# Altium project NG_0036526167_Diplomski-rad-BioMed.PrjPcb
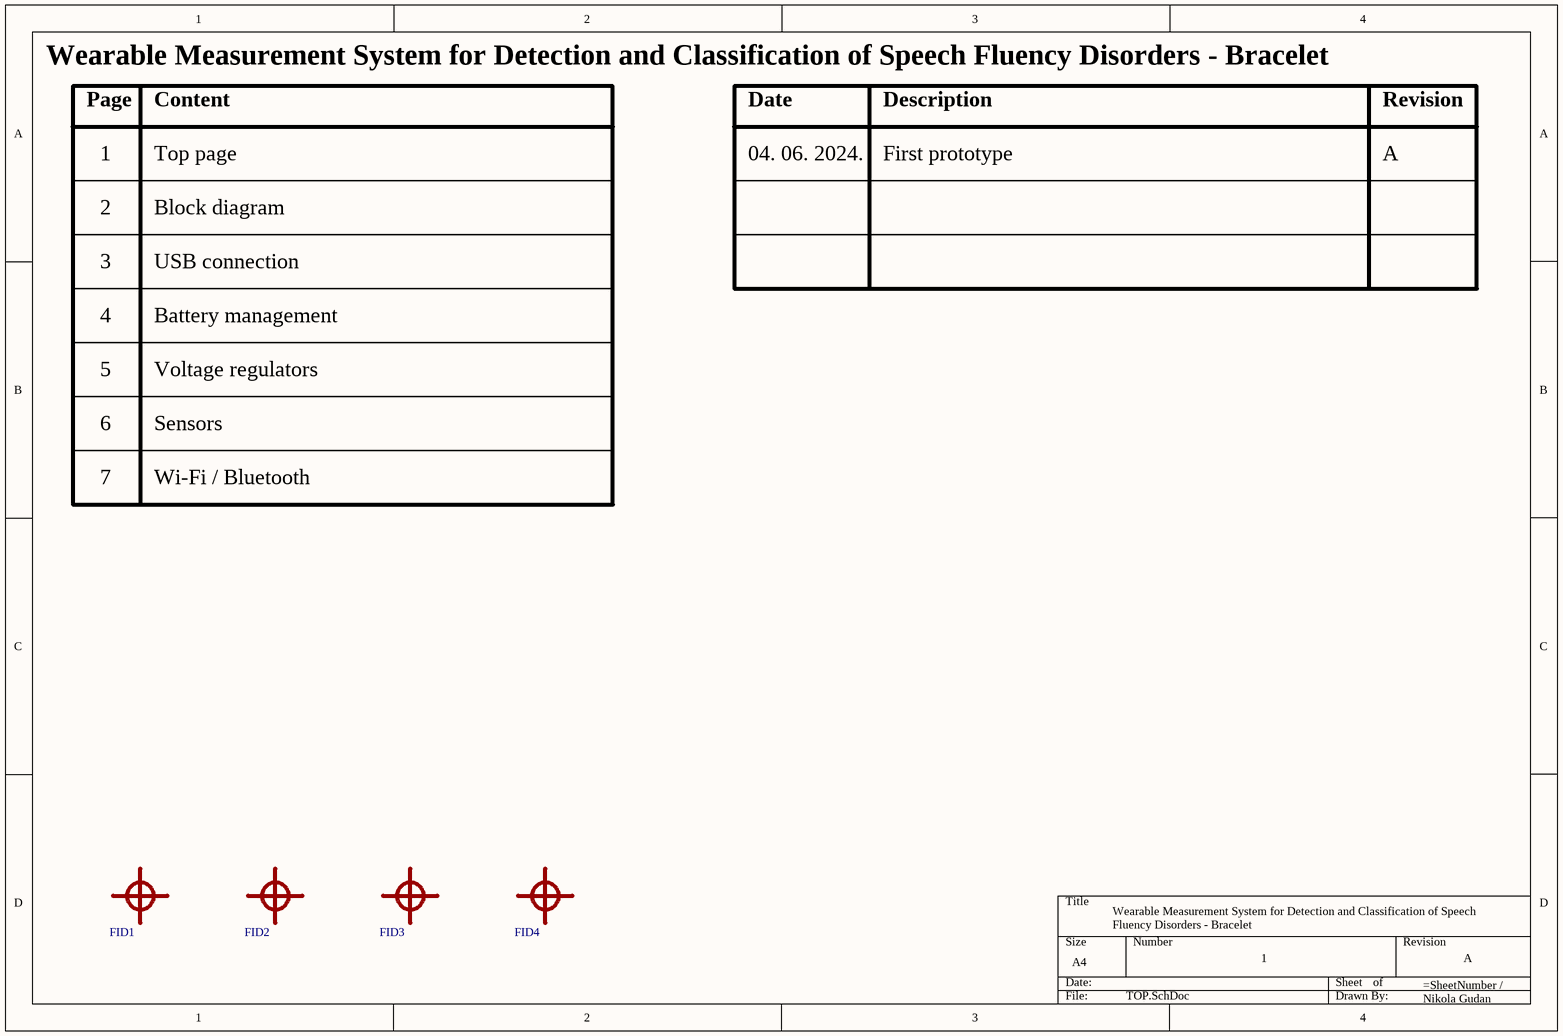
[diagram p0: TOP.SchDoc]
Engineer: Nikola Gudan; Revision: A; Title: Wearable Measurement System for Detection and Classification of Speech Fluency Disorders - Bracelet
7 sheets, 115 parts. Net scope: flat (ports and power ports of the same name join across sheets).
Board file: PCB_4-layer.PcbDoc
Sheets:
  TOP.SchDoc
  BLOCK-DIAGRAM.SchDoc
  USB.SchDoc
  CHARGER.SchDoc
  POWER.SchDoc
  SENSORS.SchDoc
  WIRELESS.SchDoc

## Sheet TOP.SchDoc: Wearable Measurement System for Detection and Classification of Speech Fluency Disorders - Bracelet
size A4; SheetNumber: 1; SheetTotal: 7

### Parts
FID1  FID  [FIDUCIAL]  (value not drawn)  (no BOM)
FID2  FID  [FIDUCIAL]  (value not drawn)  (no BOM)
FID3  FID  [FIDUCIAL]  (value not drawn)  (no BOM)
FID4  FID  [FIDUCIAL]  (value not drawn)  (no BOM)

### Notes on the sheet
- Page
- Content
- Date
- Description
- Revision
- 1
- Top page
- 04. 06. 2024.
- First prototype
- A
- 2
- Block diagram
- 3
- USB connection
- 4
- 5
- Battery management
- Voltage regulators
- 6
- Sensors
- 7
- Wi-Fi / Bluetooth

### Library data of the parts
FID1-FID4 = FIDUCIAL: Fiducial marker; Checked: Yes; Footprint: ?; MFR: ?; Supplier: Digi-Key; SPN: ?; MFRN: ?

## Sheet BLOCK-DIAGRAM.SchDoc: Wearable Measurement System for Detection and Classification of Speech Fluency Disorders - Bracelet
size A4; SheetNumber: 2; SheetTotal: 7
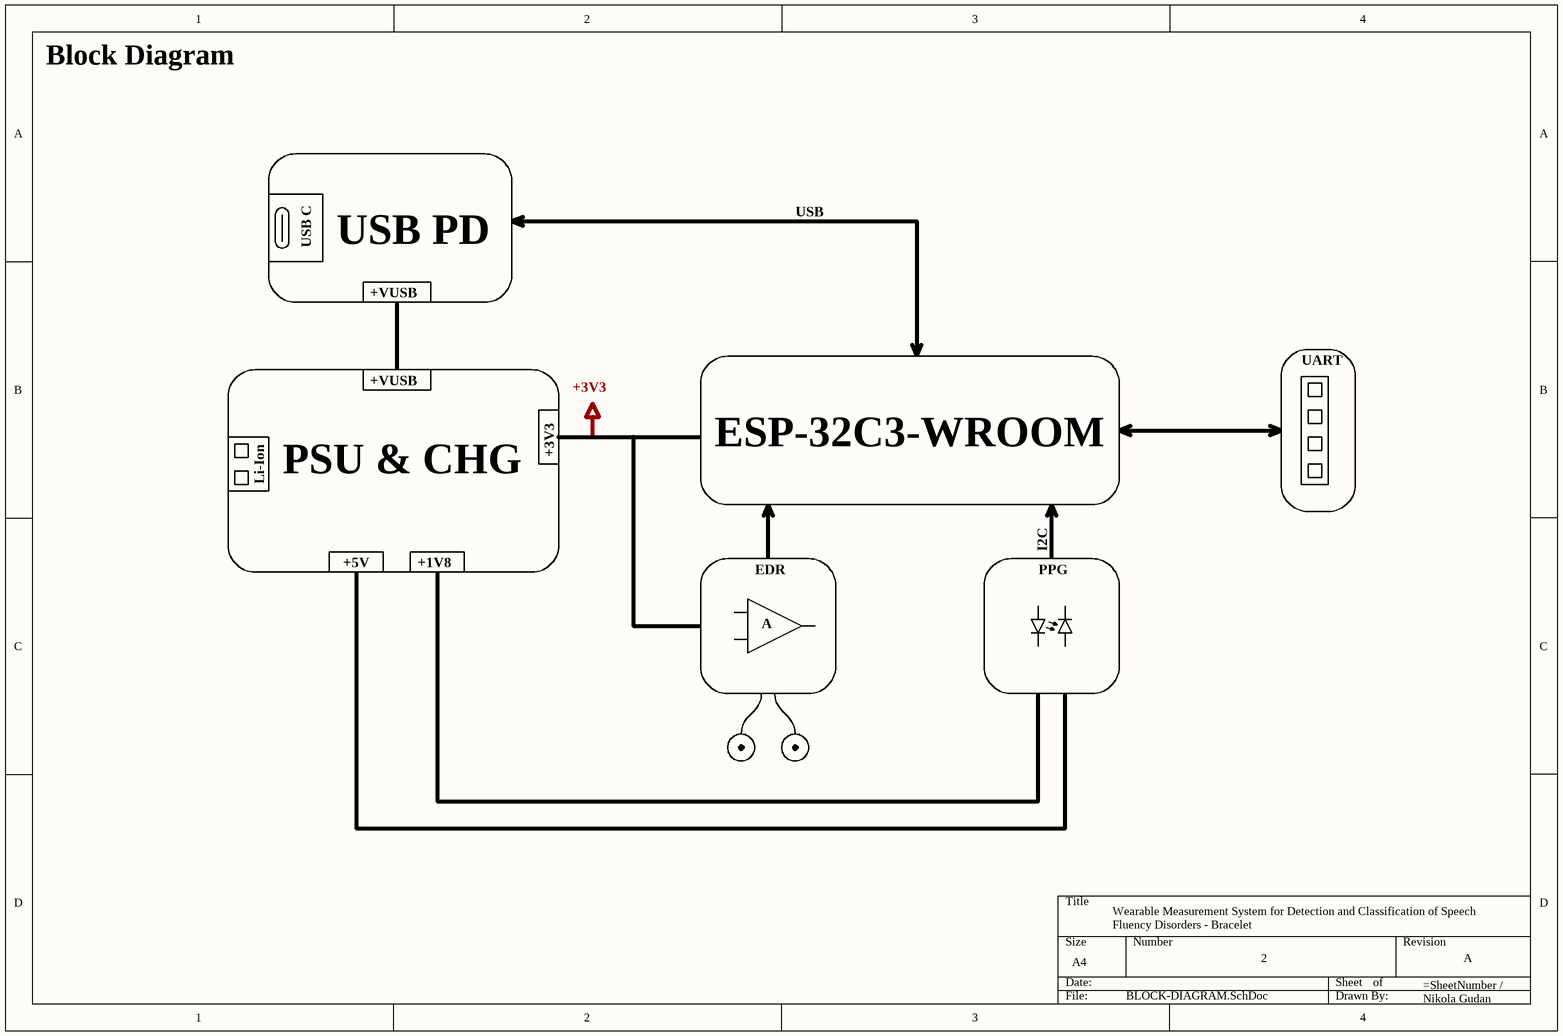
[diagram p1: BLOCK-DIAGRAM.SchDoc]

### Notes on the sheet
- Block Diagram
- USB C
- USB PD
- USB
- +VUSB
- UART
- +3V3
- Li-Ion
- PSU & CHG
- ESP-32C3-WROOM
- +5V
- +1V8
- EDR
- PPG
- I2C
- A

## Sheet USB.SchDoc: Wearable Measurement System for Detection and Classification of Speech Fluency Disorders - Bracelet
size A4; SheetNumber: 3; SheetTotal: 7
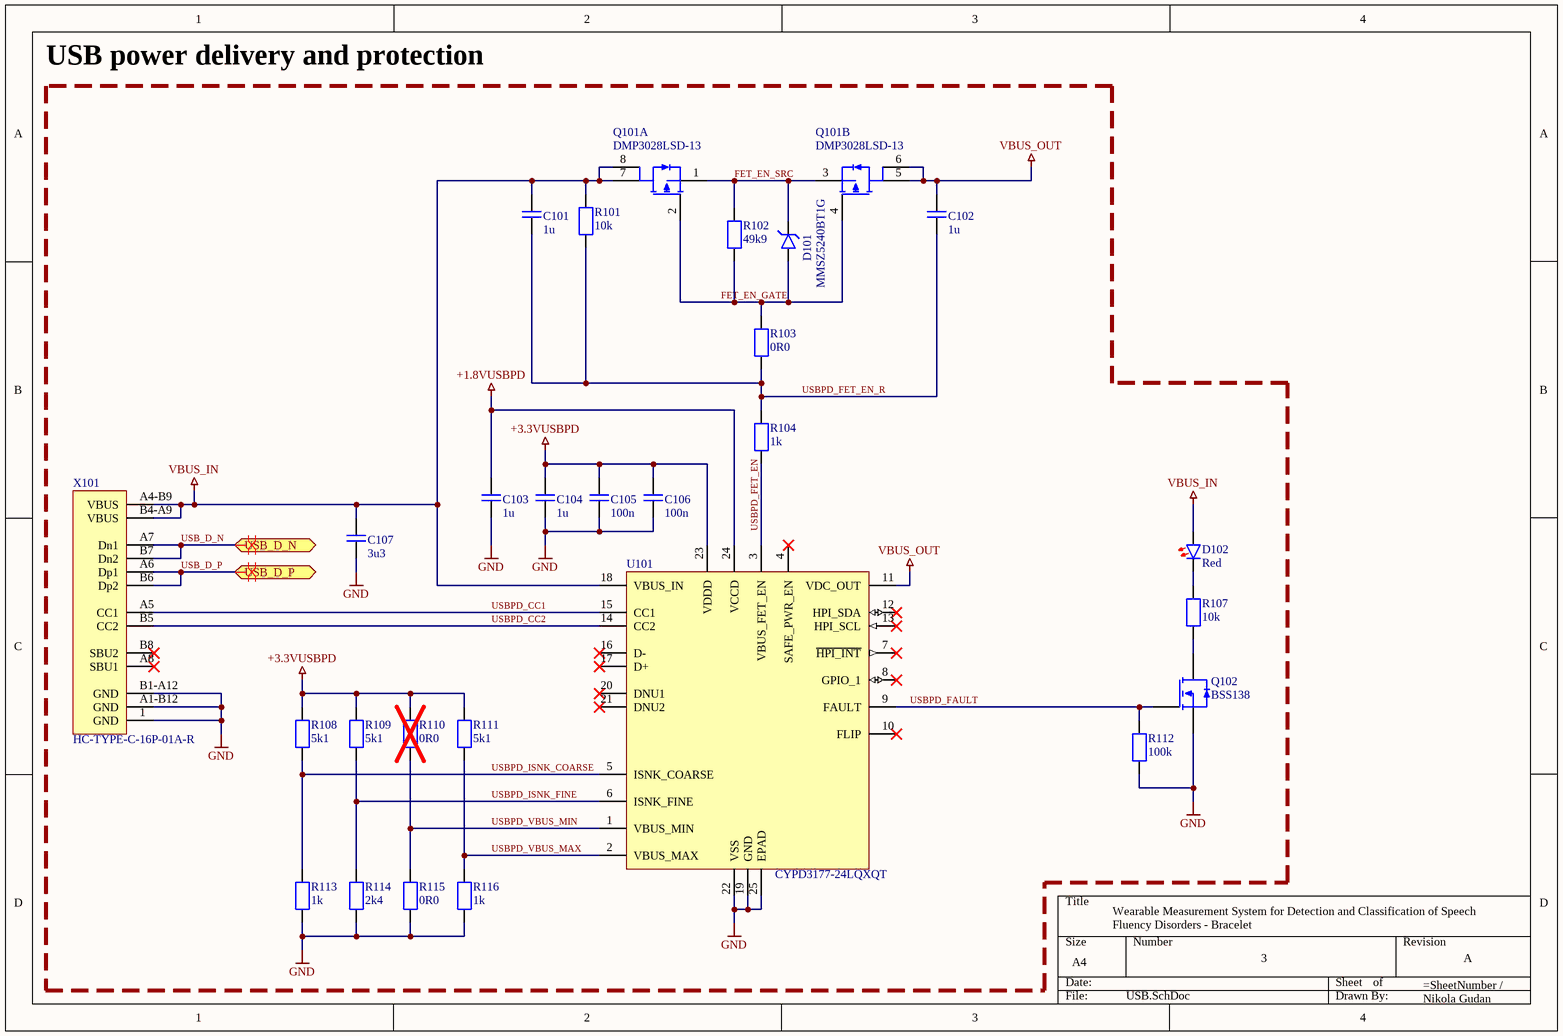
[diagram p2: USB.SchDoc]

### Parts
C101  1u  [CAPC0603]
C102  1u  [CAPC0603]
C103  1u  [CAPC0603]
C104  1u  [CAPC0603]
C105  100n  [CAPC0603]
C106  100n  [CAPC0603]
C107  3u3  [CAPC0603]
D101  MMSZ5240BT1G  [SODFL368160X117]
D102  Red  [LED0603]
Q101  DMP3028LSD-13  [SOIC127P620X175-8]  (parts A,B of 2)
Q102  BSS138  [SOT190P240X290-3]
R101  10k  [RESC0603]
R102  49k9  [RESC0603]
R103  0R0  [RESC0603]
R104  1k  [RESC0603]
R107  10k  [RESC0603]
R108  5k1  [RESC0603]
R109  5k1  [RESC0603]
R110  0R0  [RESC0603]
R111  5k1  [RESC0603]
R112  100k  [RESC0603]
R113  1k  [RESC0603]
R114  2k4  [RESC0603]
R115  0R0  [RESC0603]
R116  1k  [RESC0603]
U101  CYPD3177-24LQXQT  [QFN50P410X410X100-24EP]
X101  HC-TYPE-C-16P-01A-R  [GCT_USB4105-GF-A]

### Blocks framed on the sheet
USB power delivery and protection: C101-C107 D101 D102 Q101 Q102 R101-R104 R107-R116 U101 X101

### Ports
USB_D_N (bidir, see WIRELESS[2B]), USB_D_P (bidir, see WIRELESS[2B])

### Nets
+1.8VUSBPD: C103.2 U101.24(VCCD)
+3.3VUSBPD: C104.2 C105.2 C106.2 R108.2 R109.2 R110.2 R111.2 U101.23(VDDD)
GND: C103.1 C104.1 C105.1 C106.1 C107.1 Q102.2(S) R112.1 R113.1 R114.1 R115.1 R116.1 U101.19(GND) U101.22(VSS) U101.25(EPAD) X101.1(GND) X101.A1-B12(GND) X101.B1-A12(GND)
VBUS_IN: C101.2 C107.2 D102.2 Q101.7(D1) Q101.8(D1) R101.2 U101.18(VBUS_IN) X101.A4-B9(VBUS) X101.B4-A9(VBUS)
VBUS_OUT: C102.2 Q101.5(D2) Q101.6(D2) U101.11(VDC_OUT)
FET_EN_GATE: D101.2 Q101.2(G1) Q101.4(G2) R102.1 R103.2
FET_EN_SRC: D101.1 Q101.1(S1) Q101.3(S2) R102.2
USB_D_N: X101.A7(Dn1) X101.B7(Dn2) ; port USB_D_N
USB_D_P: X101.A6(Dp1) X101.B6(Dp2) ; port USB_D_P
USBPD_CC1: U101.15(CC1) X101.A5(CC1)
USBPD_CC2: U101.14(CC2) X101.B5(CC2)
USBPD_FAULT: Q102.1(G) R112.2 U101.9(FAULT)
USBPD_FET_EN: R104.1 U101.3(VBUS_FET_EN)
USBPD_FET_EN_R: C101.1 C102.1 R101.1 R103.1 R104.2
USBPD_ISNK_COARSE: R108.1 R113.2 U101.5(ISNK_COARSE)
USBPD_ISNK_FINE: R109.1 R114.2 U101.6(ISNK_FINE)
USBPD_VBUS_MAX: R111.1 R116.2 U101.2(VBUS_MAX)
USBPD_VBUS_MIN: R110.1 R115.2 U101.1(VBUS_MIN)
NetD102_1: D102.1 R107.2
NetQ102_3: Q102.3(D) R107.1

Not connected (* = marked no-connect by the designer): U101 4(SAFE_PWR_EN)* 7(~{HPI_INT})* 8(GPIO_1)* 10(FLIP)* 12(HPI_SDA)* 13(HPI_SCL)* 16(D-)* 17(D+)* 20(DNU1)* 21(DNU2)*; X101 A8(SBU1)* B8(SBU2)*

### Layout directives
differential pair: USB_D_N, USB_D_P

### Library data of the parts
C101-C104 = CAPC0603-1u-10: Ceramic capacitor, 1uF,  50V, X5R; MFR: Murata Electronics; MFRN: GRT188R61H105KE13D; SPN: 81-GRT188R61H105KE3D; Checked: Yes; Footprint: 0603; Supplier: Mouser; Link: https://hr.mouser.com/ProductDetail/Murata-Electronics/GRT188R61H105KE13D?qs=drgMNd%252BkGPNIxxtJByMGCg%3D%3D
C105 C106 = CAPC0603-100n-10: Ceramic capacitor, 100nF,  50V, X7R; MFR: KEMET; MFRN: C0603C104K5RACAUTO; SPN: 80-C0603C104K5RAUTO; Checked: Yes; Footprint: 0603; Supplier: Mouser; Link: https://hr.mouser.com/ProductDetail/KEMET/C0603C104K5RACAUTO?qs=8xX%252BF9%252BWV6EZsgKw9G0PqQ%3D%3D
C107 = CAPC0603-3u3-10: Ceramic capacitor, 3.3uF,  25V, X5R; MFR: TDK; MFRN: C1608X5R1E335K080AC; SPN: 810-C1608X5R1E335KAC; Checked: Yes; Footprint: 0603; Supplier: Mouser; Link: https://hr.mouser.com/ProductDetail/TDK/C1608X5R1E335K080AC?qs=6JAMGB%252BEdkxFHV26vmpHrw%3D%3D
D101 = MMSZ5240BT1G: Zener Dioode, 10V, 500mW; MFR: onsemi; SPN: 863-MMSZ5240BT1G; Checked: Yes; Footprint: SOD-123-2; Supplier: Mouser; MFRN: MMSZ5240BT1G; Link: https://hr.mouser.com/ProductDetail/onsemi/MMSZ5240BT1G?qs=P4IOph%252Bbot9clcYADZoEXg%3D%3D
D102 = 150060RS75000: LED Red, 2.3V, 20mA; MFR: Würth Elektronik; SPN: 710-150060RS75000; Checked: Yes; Footprint: 0603; Supplier: Mouser; MFRN: 150060RS75000; Link: https://hr.mouser.com/ProductDetail/Wurth-Elektronik/150060RS75000?qs=LlUlMxKIyB3QnmZ3fw%2FVCA%3D%3D
Q101 = DMP3028LSD-13: MOSFET, 2P-CH, 30V, 6A; MFR: Diodes Incorporated; SPN: 621-DMP3028LSD-13; Checked: Yes; Footprint: SOIC-8; Supplier: Mouser; MFRN: DMP3028LSD-13; Link: https://hr.mouser.com/ProductDetail/Diodes-Incorporated/DMP3028LSD-13?qs=HXx4m3XcTe1Oo5qgV%252BCezQ%3D%3D
Q102 = BSS138: MOSFET, N-CH, 50V, 220mA; MFR: onsemi; SPN: 512-BSS138; Checked: Yes; Footprint: SOT23-3; Supplier: Mouser; MFRN: BSS138; Link: https://hr.mouser.com/ProductDetail/onsemi-Fairchild/BSS138?qs=HK%252BeIG1iaahCeqBvjB4arg%3D%3D
R101 R107 = RES0603-10k-1: Thick film resistor, 10kOhm, 100mW; MFR: YAGEO; MFRN: RC0603FR-1010KL; SPN: 603-RC0603FR-1010KL; Checked: Yes; Footprint: 0603; Supplier: Mouser; Link: https://hr.mouser.com/ProductDetail/YAGEO/RC0603FR-1010KL?qs=sGAEpiMZZMtlubZbdhIBIHvQf5egq9lvqRHakiGwa0o%3D
R102 = RES0603-49k9-1: Thick film resistor, 49.9kOhms, 100mW; MFR: YAGEO; MFRN: RC0603FR-0749K9L; SPN: 603-RC0603FR-0749K9L; Checked: Yes; Footprint: 0603; Supplier: Mouser; Link: https://hr.mouser.com/ProductDetail/YAGEO/RC0603FR-0749K9L?qs=sGAEpiMZZMtlubZbdhIBIItYu4jZFrq85kB0%2FAGdri8%3D
R103 R110 R115 = RES0603-0R0-1: Thick film resistor, 0Ohms, 100mW; MFR: YAGEO; MFRN: RC0603FR-070RL; SPN: 603-RC0603FR-070RL; Checked: Yes; Footprint: 0603; Supplier: Mouser; Link: https://hr.mouser.com/ProductDetail/YAGEO/RC0603FR-070RL?qs=0yPvnVz5%2FmpDQv43TwvCfw%3D%3D
R104 R113 R116 = RES0603-1k-1: Thick film resistor, 1k, 100mW; MFR: YAGEO; MFRN: RC0603FR-071KL; SPN: 603-RC0603FR-071KL; Checked: Yes; Footprint: 0603; Supplier: Mouser; Link: https://hr.mouser.com/ProductDetail/YAGEO/RC0603FR-071KL?qs=VU8sRB4EgwApHsk4rF%2F3zg%3D%3D
R108 R109 R111 = RES0603-5k1-1: Thick film resistor, 5.1kOhms, 100mW; MFR: YAGEO; MFRN: RC0603FR-075K1L; SPN: 603-RC0603FR-075K1L; Checked: Yes; Footprint: 0603; Supplier: Mouser; Link: https://hr.mouser.com/ProductDetail/YAGEO/RC0603FR-075K1L?qs=gt6vzsuosg2jUUwxnI2PJQ%3D%3D
R112 = RES0603-100k-1: Thick film resistor, 100kOhms, 100mW; MFR: YAGEO; MFRN: CRCW0603100KFKEA; SPN: 71-CRCW0603-100K-E3; Checked: Yes; Footprint: 0603; Supplier: Mouser; Link: https://hr.mouser.com/ProductDetail/Vishay-Dale/CRCW0603100KFKEA?qs=6dqgS%252BKntICWHMMdIzt5%2FQ%3D%3D
R114 = RES0603-2k4-1: Thick film resistor, 2.4kOhms, 100mW; MFR: YAGEO; MFRN: RC0603FR-072K4L; SPN: 603-RC0603FR-072K4L; Checked: Yes; Footprint: 0603; Supplier: Mouser; Link: https://hr.mouser.com/ProductDetail/YAGEO/RC0603FR-072K4L?qs=0yPvnVz5%2FmrC6p3yyBfpHw%3D%3D
U101 = CYPD3177-24LQXQT: Generic Description; MFR: Infineon Technologies; SPN: 727-CYPD3177-24LQXQT; Checked: Yes; Footprint: 24-TQFN-EP; Supplier: Mouser; MFRN: CYPD3177-24LQXQT; Link: https://hr.mouser.com/ProductDetail/Infineon-Technologies/CYPD3177-24LQXQT?qs=PzGy0jfpSMvUfBLYWBYBLA%3D%3D
X101 = CONN USB 2.0 TYPE C: USB TYPE-C 3.1, 3A; MFR: GCT; MFRN: USB4105-GF-A; SPN: 640-USB4105-GF-A; Checked: Yes; Footprint: USB Type C; Supplier: Mouser; Link: https://hr.mouser.com/ProductDetail/GCT/USB4105-GF-A?qs=KUoIvG%2F9IlY%2FMLlBMpStpA%3D%3D

## Sheet CHARGER.SchDoc: Wearable Measurement System for Detection and Classification of Speech Fluency Disorders - Bracelet
size A4; SheetNumber: 4; SheetTotal: 7
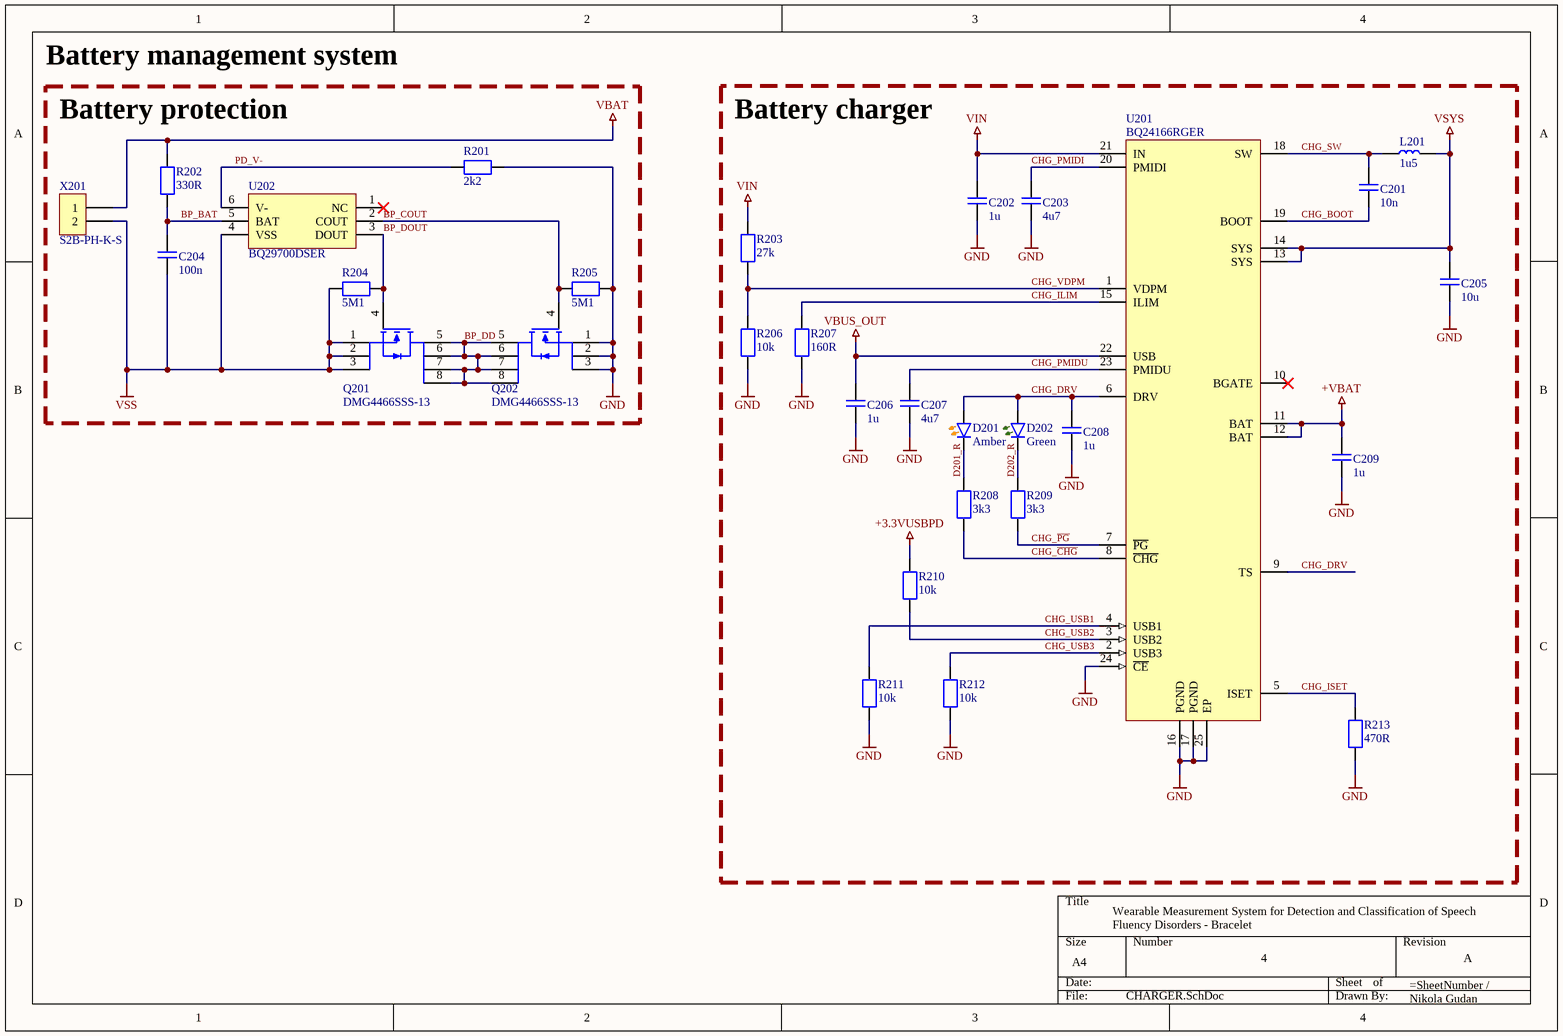
[diagram p3: CHARGER.SchDoc]

### Parts
C201  10n  [CAPC0603]
C202  1u  [CAPC0603]
C203  4u7  [CAPC0603]
C204  100n  [CAPC0603]
C205  10u  [CAPC0603]
C206  1u  [CAPC0603]
C207  4u7  [CAPC0603]
C208  1u  [CAPC0603]
C209  1u  [CAPC0603]
D201  Amber  [LED0603]
D202  Green  [LED0603]
L201  1u5  [INDC1008]
Q201  DMG4466SSS-13  [SOIC127P610X175-8]
Q202  DMG4466SSS-13  [SOIC127P610X175-8]
R201  2k2  [RESC0603]
R202  330R  [RESC0603]
R203  27k  [RESC0603]
R204  5M1  [RESC0603]
R205  5M1  [RESC0603]
R206  10k  [RESC0603]
R207  160R  [RESC0603]
R208  3k3  [RESC0603]
R209  3k3  [RESC0603]
R210  10k  [RESC0603]
R211  10k  [RESC0603]
R212  10k  [RESC0603]
R213  470R  [RESC0603]
U201  BQ24166RGER  [QFN50P410X410X100-24EP]
U202  BQ29700DSER  [WSON50P150X150X80-6]
X201  S2B-PH-K-S  [JST_S2B-PH-K-S]

### Blocks framed on the sheet
Battery charger: C201-C203 C205-C209 D201 D202 L201 R203 R206-R213 U201

### Nets
+3.3VUSBPD: R210.1
+VBAT: C209.2 U201.11(BAT) U201.12(BAT)
GND: C202.1 C203.1 C205.1 C206.1 C207.1 C208.1 C209.1 Q202.1(S) Q202.2(S) Q202.3(S) R201.1 R205.1 R206.1 R207.2 R211.2 R212.2 R213.1 U201.16(PGND) U201.17(PGND) U201.24(~{CE}) U201.25(EP)
VBAT: R202.2 X201.1
VBUS_OUT: C206.2 U201.22(USB)
VIN: C202.2 R203.2 U201.21(IN)
VSS: C204.1 Q201.1(S) Q201.2(S) Q201.3(S) R204.2 U202.4(VSS) X201.2
VSYS: C205.2 L201.2 U201.13(SYS) U201.14(SYS)
BP_BAT: C204.2 R202.1 U202.5(BAT)
BP_COUT: Q202.4(G) R205.2 U202.2(COUT)
BP_DD: Q201.5(D) Q201.6(D) Q201.7(D) Q201.8(D) Q202.5(D) Q202.6(D) Q202.7(D) Q202.8(D)
BP_DOUT: Q201.4(G) R204.1 U202.3(DOUT)
CHG_BOOT: C201.1 U201.19(BOOT)
CHG_~{CHG}: R208.1 U201.8(~{CHG})
CHG_DRV: C208.2 D201.2 D202.2 U201.6(DRV) U201.9(TS)
CHG_ILIM: R207.1 U201.15(ILIM)
CHG_ISET: R213.2 U201.5(ISET)
CHG_~{PG}: R209.1 U201.7(~{PG})
CHG_PMIDI: C203.2 U201.20(PMIDI)
CHG_PMIDU: C207.2 U201.23(PMIDU)
CHG_SW: C201.2 L201.1 U201.18(SW)
CHG_USB1: R211.1 U201.4(USB1)
CHG_USB2: R210.2 U201.3(USB2)
CHG_USB3: R212.1 U201.2(USB3)
CHG_VDPM: R203.1 R206.2 U201.1(VDPM)
D201_R: D201.1 R208.2
D202_R: D202.1 R209.2
PD_V-: R201.2 U202.6(V-)

Not connected (* = marked no-connect by the designer): U201 10(BGATE)*; U202 1(NC)*

### Notes on the sheet
- Battery management system
- (near R202) Battery protection

### Library data of the parts
C201 = CAPC0603-10n-20: Ceramic capacitor, 10nF,  50V, X7R; MFR: KEMET; MFRN: C0603C103K5RAC7081; SPN: 80-C0603C103K5R7081; Checked: Yes; Footprint: 0603; Supplier: Mouser; Link: https://hr.mouser.com/ProductDetail/KEMET/C0603C103K5RAC7081?qs=sSYV1F9c5cFnAwHdDYKUcw%3D%3D
C202 C206 C208 C209 = CAPC0603-1u-10: as C101 on sheet USB; Footprint: 0603; Supplier: Mouser; Link: https://hr.mouser.com/ProductDetail/Murata-Electronics/GRT188R61H105KE13D?qs=drgMNd%252BkGPNIxxtJByMGCg%3D%3D
C203 C207 = CAPC0603-4u7-10: Ceramic capacitor, 4.7uF, 25V, X5R; MFR: TDK; MFRN: C1608X5R1E475K080AC; SPN: 810-C1608X5R1E475K; Checked: Yes; Footprint: 0603; Supplier: Mouser; Link: https://hr.mouser.com/ProductDetail/TDK/C1608X5R1E475K080AC?qs=dfay7wIA1uHUGZGvnFtOyQ%3D%3D
C204 = CAPC0603-100n-10: as C105 on sheet USB; Footprint: 0603; Supplier: Mouser; Link: https://hr.mouser.com/ProductDetail/KEMET/C0603C104K5RACAUTO?qs=8xX%252BF9%252BWV6EZsgKw9G0PqQ%3D%3D
C205 = CAPC0603-10u-20: Ceramic capacitor, 10uF,  25V, X5R; MFR: TAIYO YUDEN; MFRN: TMK107BBJ106MA-T; SPN: 963-TMK107BBJ106MA-T; Checked: Yes; Footprint: 0603; Supplier: Mouser; Link: https://hr.mouser.com/ProductDetail/TAIYO-YUDEN/TMK107BBJ106MA-T?qs=lkMpTOwszhf2a50BCYsq8A%3D%3D
D201 = 150060AS75000: LED Amber, 2V, 30mA; MFR: Würth Elektronik; SPN: 710-150060AS75000; Checked: Yes; Footprint: 0603; Supplier: Mouser; MFRN: 150060AS75000; Link: https://hr.mouser.com/ProductDetail/Wurth-Elektronik/150060AS75000?qs=d0WKAl%252BL4KbvMBYryeof0Q%3D%3D
D202 = 150060GS75000: LED Green, 2.1V, 20mA; MFR: Wurth Elektronik; SPN: 710-150060GS75000; Checked: Yes; Footprint: 0603; Supplier: Mouser; MFRN: 150060GS75000; Link: https://hr.mouser.com/ProductDetail/Wurth-Elektronik/150060GS75000?qs=LlUlMxKIyB0UYkq5lDO8nA%3D%3D
L201 = INDC1008-1u5-20: Inductor 1.5uH, 3.3A, ±20%, 60mOhm; MFR: TDK; MFRN: TMS252012ALM-1R5MTAA; SPN: 810-TMS252012ALM1R5M; Checked: Yes; Footprint: 1008; Supplier: Mouser; Link: https://hr.mouser.com/ProductDetail/TDK/TMS252012ALM-1R5MTAA?qs=7MVldsJ5UayRLHp7atJZag%3D%3D
Q201 Q202 = DMG4466SSS-13: MOSFET, N-CH, 30V, 10A; MFR: Diodes Incorporated; SPN: 621-DMG4466SSS-13; Checked: Yes; Footprint: SOIC-8; Supplier: Mouser; MFRN: DMG4466SSS-13; Link: https://hr.mouser.com/ProductDetail/Diodes-Incorporated/DMG4466SSS-13?qs=sJ%252BpcIzCtBiZrDaWKxeDlA%3D%3D
R201 = RES0603-2k2-1: Thick film resistor, 2.2kOhms, 100mW; MFR: YAGEO; MFRN: RC0603FR-072K2L; SPN: 603-RC0603FR-072K2L; Checked: Yes; Footprint: 0603; Supplier: Mouser; Link: https://hr.mouser.com/ProductDetail/YAGEO/RC0603FR-072K2L?qs=diQw95jMAeOQmNpe2MM%252BPw%3D%3D
R202 = RES0603-330R-1: Thick film resistor, 330Ohms, 100mW; MFR: YAGEO; MFRN: RT0603FRE13330RL; SPN: 603-RT0603FRE13330RL; Checked: Yes; Footprint: 0603; Supplier: Mouser; Link: https://hr.mouser.com/ProductDetail/YAGEO/RT0603FRE13330RL?qs=sGAEpiMZZMtlubZbdhIBIMaxnMKvEBNdDzkYru5tzsM%3D
R203 = RES0603-27-1: Thick film resistor, 27kOhm, 100mW; MFR: YAGEO; MFRN: RC0603FR-0727KL; SPN: 603-RC0603FR-0727KL; Checked: Yes; Footprint: 0603; Supplier: Mouser; Link: https://hr.mouser.com/ProductDetail/YAGEO/RC0603FR-0727KL?qs=HhmREhdzqomUcJ5okwKG7g%3D%3D
R204 R205 = RES0603-5M1-1: Thick film resistor, 5.1MOhms, 100mW; MFR: YAGEO; MFRN: RC0603FR-075M1L; SPN: 603-RC0603FR-075M1L; Checked: Yes; Footprint: 0603; Supplier: Mouser; Link: https://hr.mouser.com/ProductDetail/YAGEO/RC0603FR-075M1L?qs=EiqXWrxQq62YzjenV3bCvA%3D%3D
R206 R210-R212 = RES0603-10k-1: as R101 on sheet USB; Footprint: 0603; Supplier: Mouser; Link: https://hr.mouser.com/ProductDetail/YAGEO/RC0603FR-1010KL?qs=sGAEpiMZZMtlubZbdhIBIHvQf5egq9lvqRHakiGwa0o%3D
R207 = RES0603-160R-1: Thick film resistor, 160Ohms, 100mW; MFR: Panasonic; MFRN: ERJ-3EKF1600V; SPN: 667-ERJ-3EKF1600V; Checked: Yes; Footprint: 0603; Supplier: Mouser; Link: https://hr.mouser.com/ProductDetail/Panasonic/ERJ-3EKF1600V?qs=iBwFsHVUAOdeFCQ863k5IQ%3D%3D
R208 R209 = RES0603-3k3-1: Thick film resistor, 3.3kOhms, 100mW; MFR: YAGEO; MFRN: AC0603FR-073K3L; SPN: 603-AC0603FR-073K3L; Checked: Yes; Footprint: 0603; Supplier: Mouser; Link: https://hr.mouser.com/ProductDetail/YAGEO/AC0603FR-073K3L?qs=sGAEpiMZZMtlubZbdhIBINBo7nw4llFtjb1EiDJ1uvY%3D
R213 = RES0603-470R-1: Thick film resistor, 470R, 100mW; MFR: YAGEO; MFRN: RC0603FR-07470RL; SPN: 603-RC0603FR-07470RL; Checked: Yes; Footprint: 0603; Supplier: Mouser; Link: https://hr.mouser.com/ProductDetail/YAGEO/RC0603FR-07470RL?qs=gt6vzsuosg2Xv5elfMBXPA%3D%3D
U201 = IC BATT CHG LI-ION BQ24166: IC Battery Charger, Li-Ion, 1 Cell, 3.7V, 2.5A; MFR: Texas Instruments; SPN: 595-BQ24166RGER; Checked: Yes; Footprint: VQFN-24; Supplier: Mouser; MFRN: BQ24166RGER; Link: https://hr.mouser.com/ProductDetail/Texas-Instruments/BQ24166RGER?qs=63LrFSLv3u%252BNG%2F5wEYuQNQ%3D%3D
U202 = IC BATT PROT BQ29700DSER: Battery Protection IC Li-Ion 1Cell; MFR: Texas Instruments; SPN: 595-BQ29700DSER; Checked: Yes; Footprint: WSON-6; Supplier: Mouser; MFRN: BQ29700DSER; Link: https://hr.mouser.com/ProductDetail/Texas-Instruments/BQ29700DSER?qs=%2Fd%252BFzHvH4c3zNh7Hkm%2Fvbw%3D%3D
X201 = JST S2B-PH-K-S: JST PH Connector 2POS R/A THT; MFR: JST Sales America Inc.; SPN: 455-1719-ND; Checked: Yes; Supplier: Digi-Key; MFRN: S2B-PH-K-S; Link: https://www.digikey.com/en/products/detail/jst-sales-america-inc/S2B-PH-K-S/926626

## Sheet POWER.SchDoc: Wearable Measurement System for Detection and Classification of Speech Fluency Disorders - Bracelet
size A4; SheetNumber: 5; SheetTotal: 7
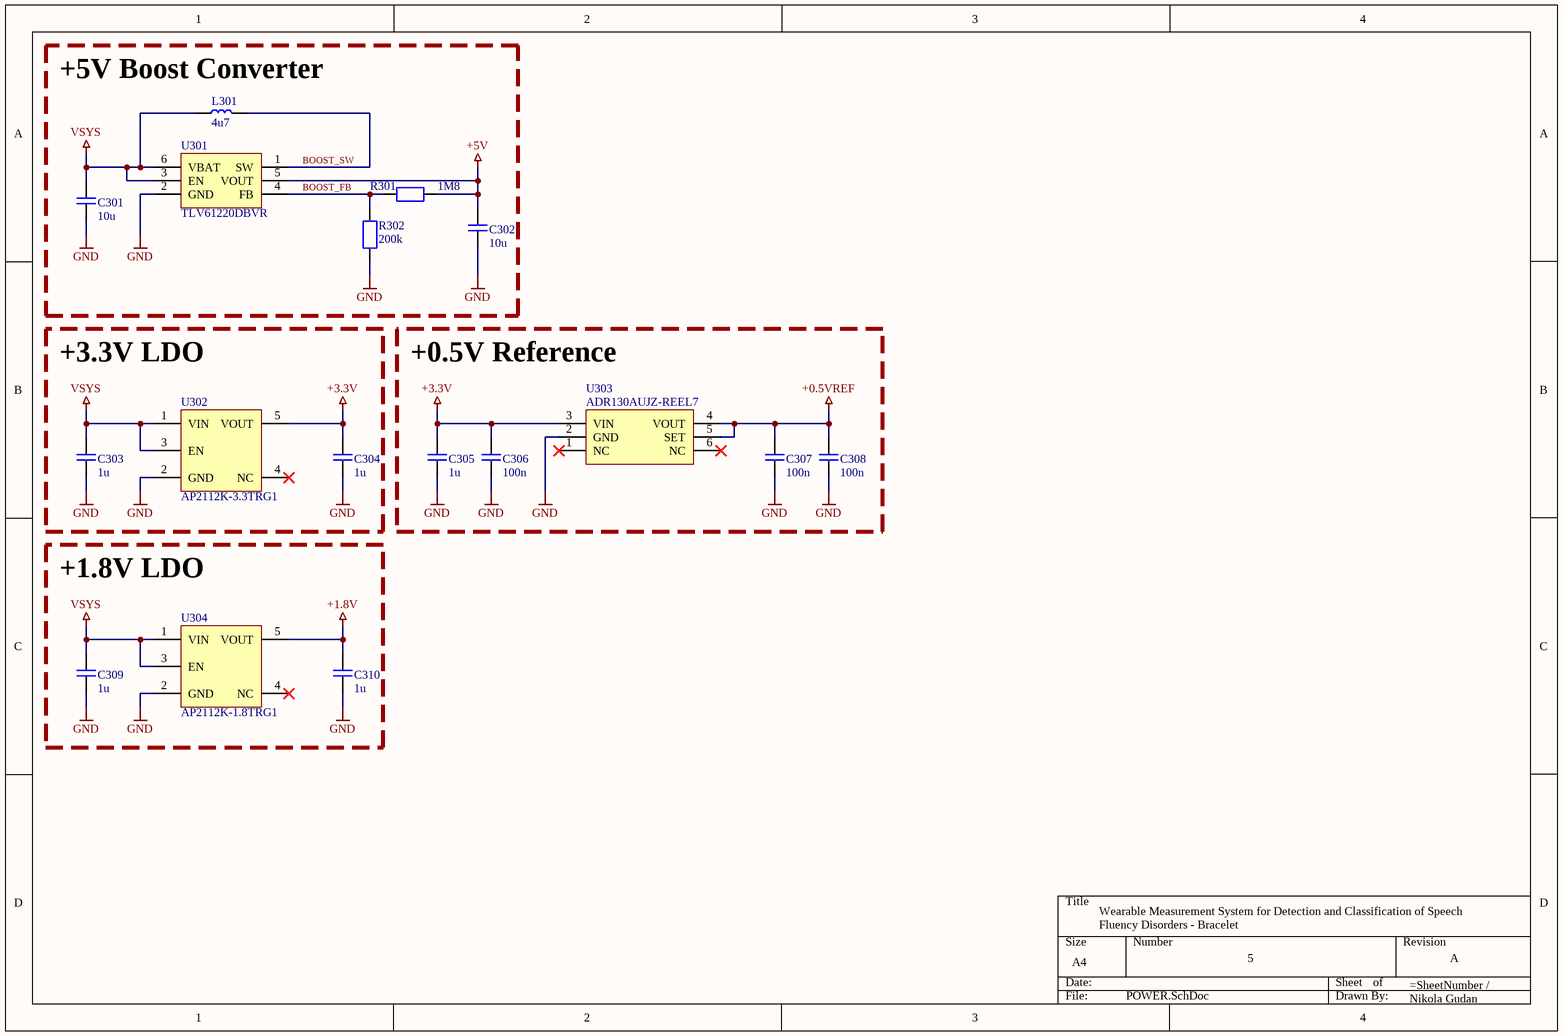
[diagram p4: POWER.SchDoc]

### Parts
C301  10u  [CAPC0603]
C302  10u  [CAPC0603]
C303  1u  [CAPC0603]
C304  1u  [CAPC0603]
C305  1u  [CAPC0603]
C306  100n  [CAPC0603]
C307  100n  [CAPC0603]
C308  100n  [CAPC0603]
C309  1u  [CAPC0603]
C310  1u  [CAPC0603]
L301  4u7  [INDC1007]
R301  1M8  [RESC0603]
R302  200k  [RESC0603]
U301  TLV61220DBVR  [SOT95P280X115-6]
U302  AP2112K-3.3TRG1  [SOT95P280X115-5]
U303  ADR130AUJZ-REEL7  [SOT95P280X115-6]
U304  AP2112K-1.8TRG1  [SOT95P280X115-5]

### Blocks framed on the sheet
+5V Boost Converter: C301 C302 L301 R301 R302 U301
+3.3V LDO: C303 C304 U302
+0.5V Reference: C305-C308 U303
+1.8V LDO: C309 C310 U304

### Nets
+0.5VREF: C307.2 C308.2 U303.4(VOUT) U303.5(SET)
+1.8V: C310.2 U304.5(VOUT)
+3.3V: C304.2 C305.2 C306.2 U302.5(VOUT) U303.3(VIN)
+5V: C302.2 R301.2 U301.5(VOUT)
GND: C301.1 C302.1 C303.1 C304.1 C305.1 C306.1 C307.1 C308.1 C309.1 C310.1 R302.1 U301.2(GND) U302.2(GND) U303.2(GND) U304.2(GND)
VSYS: C301.2 C303.2 C309.2 L301.1 U301.3(EN) U301.6(VBAT) U302.1(VIN) U302.3(EN) U304.1(VIN) U304.3(EN)
BOOST_FB: R301.1 R302.2 U301.4(FB)
BOOST_SW: L301.2 U301.1(SW)

Not connected (* = marked no-connect by the designer): U302 4(NC)*; U303 1(NC)* 6(NC)*; U304 4(NC)*

### Library data of the parts
C301 C302 = CAPC0603-10u-20: as C205 on sheet CHARGER; Footprint: 0603; Supplier: Mouser; Link: https://hr.mouser.com/ProductDetail/TAIYO-YUDEN/TMK107BBJ106MA-T?qs=lkMpTOwszhf2a50BCYsq8A%3D%3D
C303-C305 C309 C310 = CAPC0603-1u-10: as C101 on sheet USB; Footprint: 0603; Supplier: Mouser; Link: https://hr.mouser.com/ProductDetail/Murata-Electronics/GRT188R61H105KE13D?qs=drgMNd%252BkGPNIxxtJByMGCg%3D%3D
C306-C308 = CAPC0603-100n-10: as C105 on sheet USB; Footprint: 0603; Supplier: Mouser; Link: https://hr.mouser.com/ProductDetail/KEMET/C0603C104K5RACAUTO?qs=8xX%252BF9%252BWV6EZsgKw9G0PqQ%3D%3D
L301 = INDC1007-4u7-20: Inductor 4.7uH, 680mA, ±20%, 260mOhm; MFR: TAIYO YUDEN; MFRN: CBC2518T4R7M; SPN: 963-CBC2518T4R7M; Checked: Yes; Footprint: 1008; Supplier: Mouser; Link: https://hr.mouser.com/ProductDetail/TAIYO-YUDEN/CBC2518T4R7M?qs=sGAEpiMZZMv126LJFLh8y8CHgMb6WLnpfdgzSjZMuh8%3D
R301 = RES0603-1M8-1: Thick film resistor, 1.8MOhms, 100mW; MFR: Vishay / Dale; MFRN: CRCW06031M80FKEAC; SPN: 71-CRCW06031M80FKEAC; Checked: Yes; Footprint: 0603; Supplier: Mouser; Link: https://hr.mouser.com/ProductDetail/Vishay-Dale/CRCW06031M80FKEAC?qs=sGAEpiMZZMtlubZbdhIBIEVnJA25NYWZ%2FYivauIjUrk%3D
R302 = RES0603-200k-1: Thick film resistor, 200kOhms, 100mW; MFR: YAGEO; MFRN: RC0603FR-07200KL; SPN: 603-RC0603FR-07200KL; Checked: Yes; Footprint: 0603; Supplier: Mouser; Link: https://hr.mouser.com/ProductDetail/YAGEO/RC0603FR-07200KL?qs=sGAEpiMZZMtlubZbdhIBIPpBVm91En7n1EStA3IWCIA%3D
U301 = BOOST TLV61220DBVR: Boost converter, 0.7V to 5.5V Input; MFR: Texas Instruments; SPN: 595-TLV61220DBVR; Checked: No; Footprint: SOT-23; Supplier: Mouser; MFRN: TLV61220DBVR; Link: https://hr.mouser.com/ProductDetail/Texas-Instruments/TLV61220DBVR?qs=l6ZoeTYLMwOr7SC1DbpfZQ%3D%3D
U302 = IC REG LINEAR AP2112K-3.3TRG1: Linear LDO Voltage Regulator, 3.3V, 600mA; MFR: Diodes Incorporated; SPN: 621-AP2112K-3.3TRG1; Checked: Yes; Footprint: SOT-25-5; Supplier: Mouser; MFRN: AP2112K-3.3TRG1; Link: https://hr.mouser.com/ProductDetail/Diodes-Incorporated/AP2112K-3.3TRG1?qs=sGAEpiMZZMug9GoBKXZ7571prORexT17l%252BdJyLTK7uthQsHsGnYZAw%3D%3D
U303 = IC VREF ADR130AUJZ-REEL7: Voltage reference, 0.5V or 1V; MFR: Analog Devices; SPN: 584-ADR130AUJZ-R7; Checked: No; Footprint: TSOT-6; Supplier: Mouser; MFRN: ADR130AUJZ-REEL7; Link: https://hr.mouser.com/ProductDetail/Analog-Devices/ADR130AUJZ-REEL7?qs=WIvQP4zGangoCvzzhVb1kQ%3D%3D
U304 = IC REG LINEAR AP2112K-1.8TRG1: Linear LDO Voltage Regulator, 1.8V, 600mA; MFR: Diodes Incorporated; SPN: 621-AP2112K-1.8TRG1; Checked: Yes; Footprint: SOT-25-5; Supplier: Mouser; MFRN: AP2112K-1.8TRG1; Link: https://hr.mouser.com/ProductDetail/Diodes-Incorporated/AP2112K-1.8TRG1?qs=x6A8l6qLYDBx1xhw8AX2cw%3D%3D

## Sheet SENSORS.SchDoc: Wearable Measurement System for Detection and Classification of Speech Fluency Disorders - Bracelet
size A4; SheetNumber: 6; SheetTotal: 7
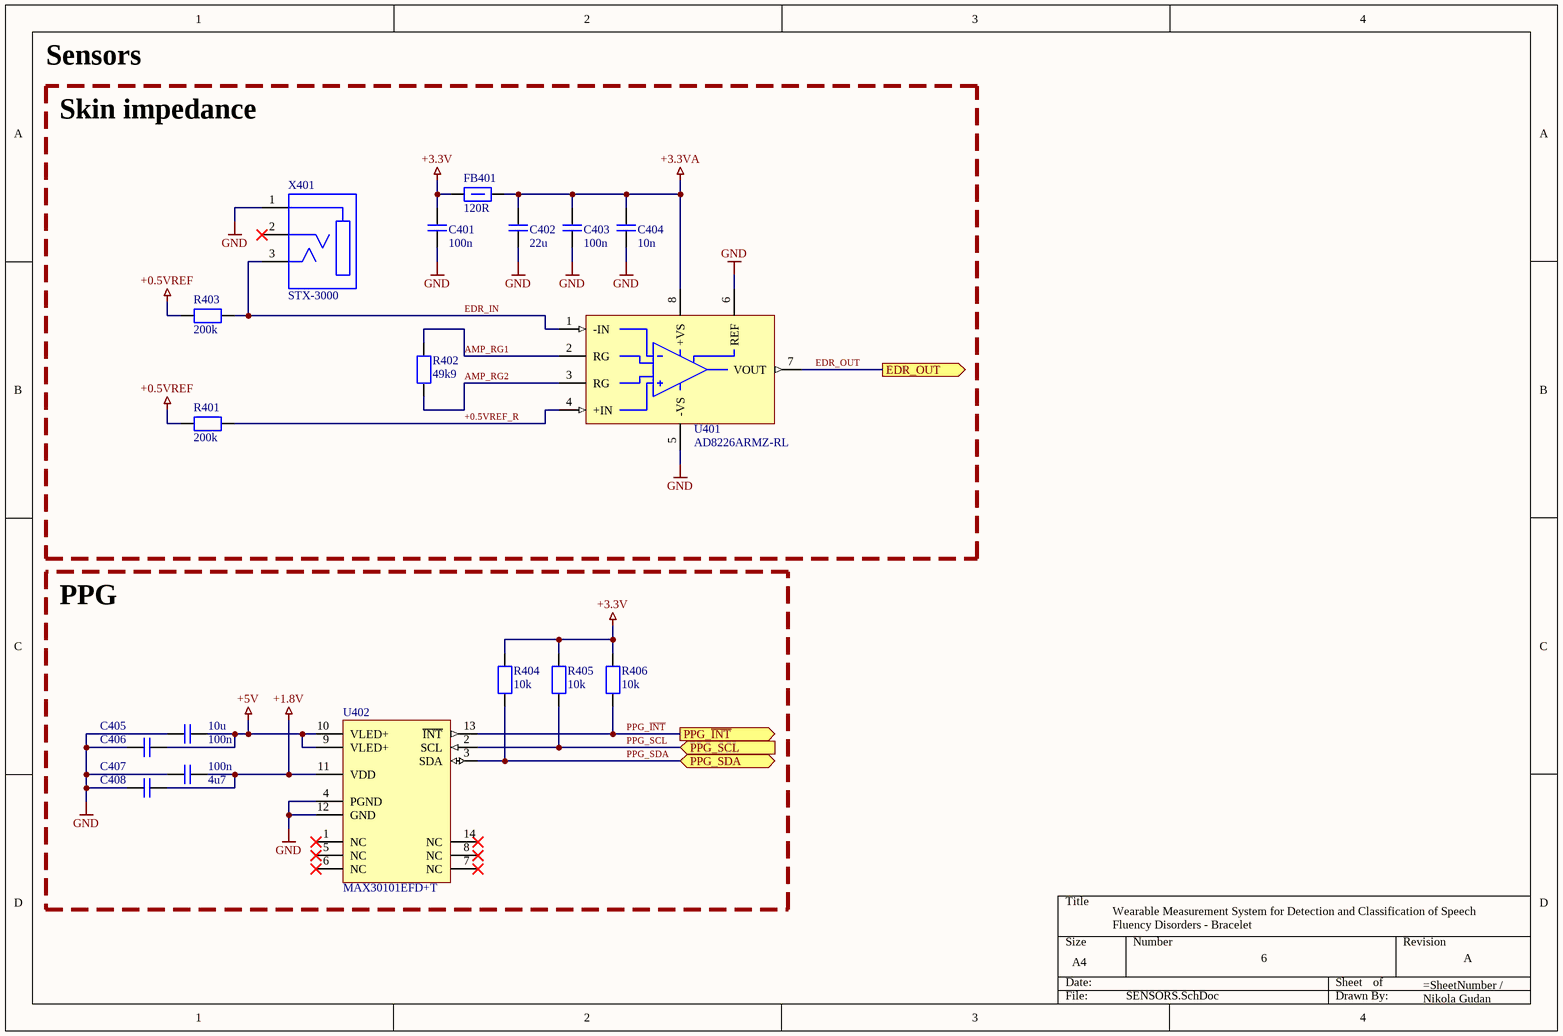
[diagram p5: SENSORS.SchDoc]

### Parts
C401  100n  [CAPC0603]
C402  22u  [CAPC0603]
C403  100n  [CAPC0603]
C404  10n  [CAPC0603]
C405  10u  [CAPC0603]
C406  100n  [CAPC0603]
C407  100n  [CAPC0603]
C408  4u7  [CAPC0603]
FB401  120R  [FBC0603]
R401  200k  [RESC0603]
R402  49k9  [RESC0603]
R403  200k  [RESC0805]
R404  10k  [RESC0603]
R405  10k  [RESC0603]
R406  10k  [RESC0603]
U401  AD8226ARMZ-RL  [SOP65P530X110-8]
U402  MAX30101EFD+T  [QFN80P330X560X155-14]
X401  STX-3000  [AUDIO STX-3000]

### Blocks framed on the sheet
PPG: C405-C408 R404-R406 U402

### Ports
EDR_OUT (out, see WIRELESS[1B]), PPG_SCL (in, see WIRELESS[1B]), PPG_SDA (bidir, see WIRELESS[1B]), PPG_~{INT} (out, see WIRELESS[1B])

### Nets
+0.5VREF: R401.2 R403.1
+1.8V: C407.2 C408.2 U402.11(VDD)
+3.3V: C401.2 FB401.1 R404.2 R405.2 R406.2
+3.3VA: C402.2 C403.2 C404.2 FB401.2 U401.8(+VS)
+5V: C405.2 C406.2 U402.9(VLED+) U402.10(VLED+)
GND: C401.1 C402.1 C403.1 C404.1 C405.1 C406.1 C407.1 C408.1 U401.5(-VS) U401.6(REF) U402.4(PGND) U402.12(GND) X401.1
+0.5VREF_R: R401.1 U401.4(+IN)
AMP_RG1: R402.2 U401.2(RG)
AMP_RG2: R402.1 U401.3(RG)
EDR_IN: R403.2 U401.1(-IN) X401.3
EDR_OUT: U401.7(VOUT) ; port EDR_OUT
PPG_~{INT}: R406.1 U402.13(~{INT}) ; port PPG_~{INT}
PPG_SCL: R405.1 U402.2(SCL) ; port PPG_SCL
PPG_SDA: R404.1 U402.3(SDA) ; port PPG_SDA

Not connected (* = marked no-connect by the designer): U402 1(NC)* 5(NC)* 6(NC)* 7(NC)* 8(NC)* 14(NC)*; X401 2*

### Notes on the sheet
- Sensors
- Skin impedance

### Library data of the parts
C401 C403 C406 C407 = CAPC0603-100n-10: as C105 on sheet USB; Footprint: 0603; Supplier: Mouser; Link: https://hr.mouser.com/ProductDetail/KEMET/C0603C104K5RACAUTO?qs=8xX%252BF9%252BWV6EZsgKw9G0PqQ%3D%3D
C402 = CAPC0603-22u-20: Ceramic capacitor, 22uF,  10V, X5R; MFR: Samsung Electro-Mechanics; MFRN: CL10A226MP8NUNE; SPN: 187-CL10A226MP8NUNE; Checked: Yes; Footprint: 0603; Supplier: Mouser; Link: https://hr.mouser.com/ProductDetail/Samsung-Electro-Mechanics/CL10A226MP8NUNE?qs=gRKWieUq2Hb5O0PTfRKzDQ%3D%3D
C404 = CAPC0603-10n-20: as C201 on sheet CHARGER; Footprint: 0603; Supplier: Mouser; Link: https://hr.mouser.com/ProductDetail/KEMET/C0603C103K5RAC7081?qs=sSYV1F9c5cFnAwHdDYKUcw%3D%3D
C405 = CAPC0603-10u-20: as C205 on sheet CHARGER; Footprint: 0603; Supplier: Mouser; Link: https://hr.mouser.com/ProductDetail/TAIYO-YUDEN/TMK107BBJ106MA-T?qs=lkMpTOwszhf2a50BCYsq8A%3D%3D
C408 = CAPC0603-4u7-10: as C203 on sheet CHARGER; Footprint: 0603; Supplier: Mouser; Link: https://hr.mouser.com/ProductDetail/TDK/C1608X5R1E475K080AC?qs=dfay7wIA1uHUGZGvnFtOyQ%3D%3D
FB401 = FB0603-120R: Ferrite bead, 120R@100MHz; MFR: TDK Corporation; MFRN: MMZ1608D121CTDH5; SPN: 445-MMZ1608D121CTDH5TR-ND; Checked: Yes; Footprint: 0603; Supplier: Mouser; Link: https://hr.mouser.com/ProductDetail/TDK/MMZ1608D121CTDH5?qs=w5GL7EWTenmYwq5el8mPmQ%3D%3D
R401 = RES0603-200k-1: as R302 on sheet POWER; Footprint: 0603; Supplier: Mouser; Link: https://hr.mouser.com/ProductDetail/YAGEO/RC0603FR-07200KL?qs=sGAEpiMZZMtlubZbdhIBIPpBVm91En7n1EStA3IWCIA%3D
R402 = RES0603-49k9-1: as R102 on sheet USB; Footprint: 0603; Supplier: Mouser; Link: https://hr.mouser.com/ProductDetail/YAGEO/RC0603FR-0749K9L?qs=sGAEpiMZZMtlubZbdhIBIItYu4jZFrq85kB0%2FAGdri8%3D
R403 = RES0805-200k-1: Thick film resistor, 200k, 125mW; MFR: YAGEO; MFRN: RC0805FR-07200KL; SPN: 603-RC0805FR-07200KL; Checked: No; Footprint: 0805; Supplier: Mouser; Link: https://hr.mouser.com/ProductDetail/YAGEO/RC0805FR-07200KL?qs=sGAEpiMZZMtlubZbdhIBIBEZimkhVqQ42qt0Z2hzgyc%3D
R404-R406 = RES0603-10k-1: as R101 on sheet USB; Footprint: 0603; Supplier: Mouser; Link: https://hr.mouser.com/ProductDetail/YAGEO/RC0603FR-1010KL?qs=sGAEpiMZZMtlubZbdhIBIHvQf5egq9lvqRHakiGwa0o%3D
U401 = AD8226ARMZ-RL: Instrumentation Amplifier, 1 CH; MFR: Analog Devices; SPN: 584-AD8226ARMZ-R; Checked: No; Footprint: MSOP-8; Supplier: Mouser; MFRN: AD8226ARMZ-RL; Link: https://hr.mouser.com/ProductDetail/Analog-Devices/AD8226ARMZ-RL?qs=sGAEpiMZZMtuedWc5vOqGOg2P2zBW3ua3%252BX8tTUXoKc%3D
U402 = BIO IC MAX30101EFD+T: Pulse Oximeter and Heart-Rate Sensor for Wearable Health; MFR: Analog Devices Inc./Maxim Integrated; SPN: 700-MAX30101EFD+T; Checked: No; Footprint: ?; Supplier: Mouser; MFRN: MAX30101EFD+T; Link: https://hr.mouser.com/ProductDetail/Analog-Devices-Maxim-Integrated/MAX30101EFD%2bT?qs=sITqEBh490kEm6CNcTH1tQ%3D%3D
X401 = AUDIO STX-3000: 3.5mm Audio connector, 3POS; MFR: Kycon; SPN: 806-STX-3000; Checked: No; Supplier: Mouser; MFRN: STX-3000; Link: https://hr.mouser.com/ProductDetail/Kycon/STX-3000?qs=sGAEpiMZZMv0W4pxf2HiV8G8PVhdMuD0EShHAQC6epY%3D

## Sheet WIRELESS.SchDoc: Wearable Measurement System for Detection and Classification of Speech Fluency Disorders - Bracelet
size A4; SheetNumber: 7; SheetTotal: 7
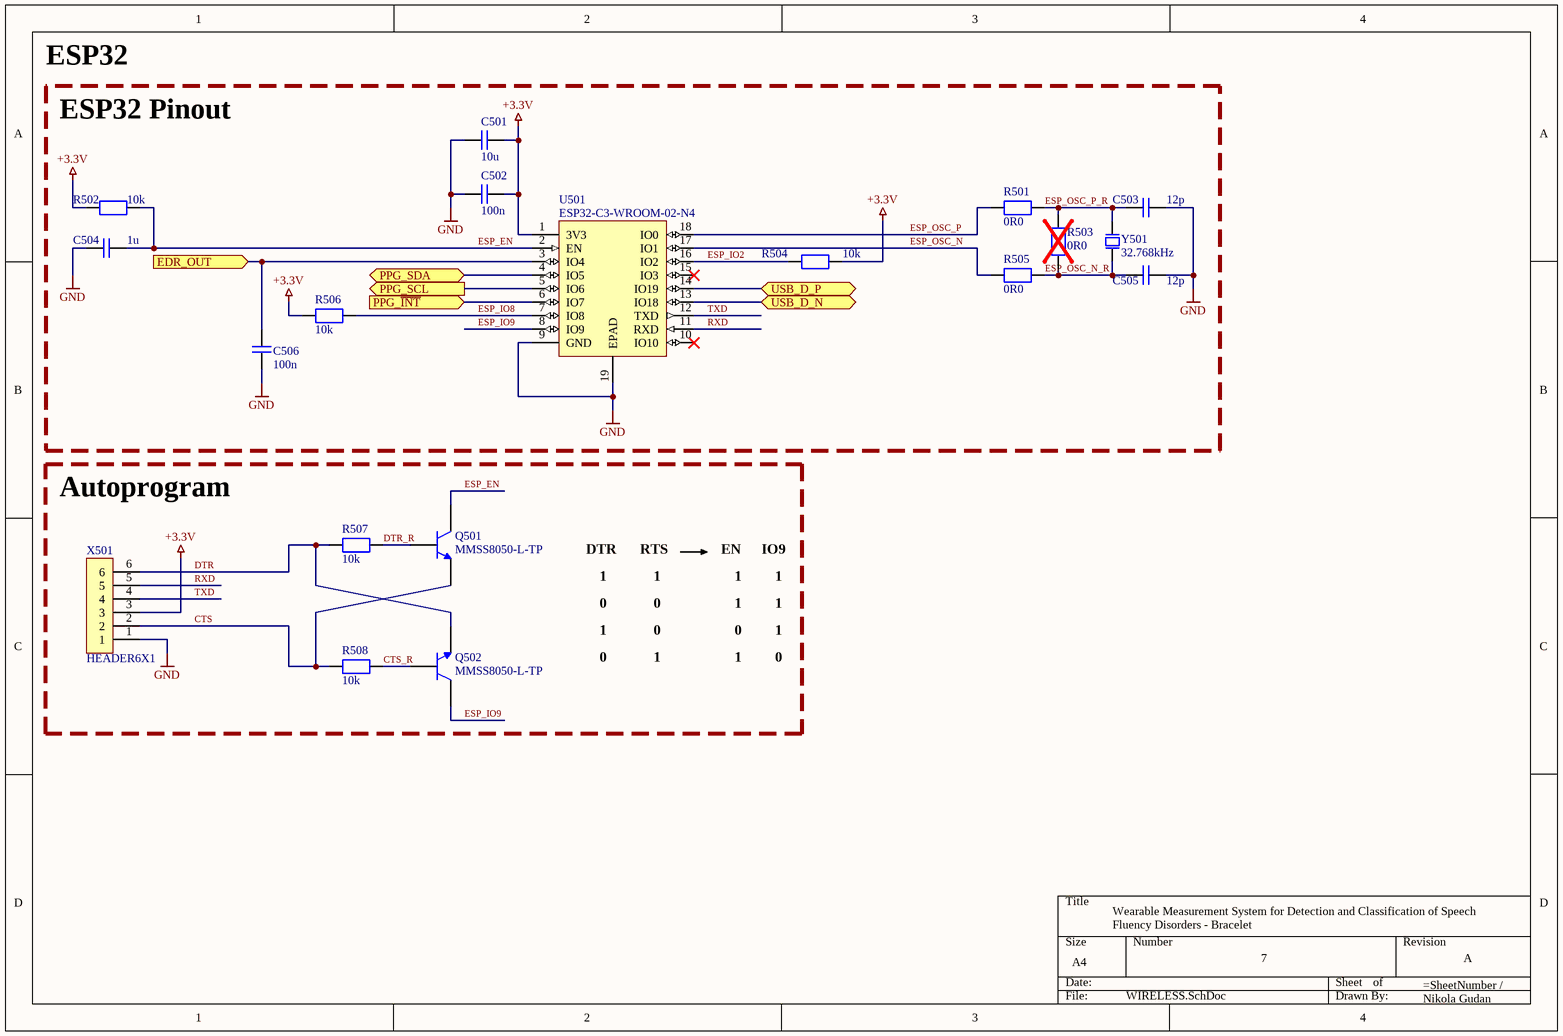
[diagram p6: WIRELESS.SchDoc]

### Parts
C501  10u  [CAPC0603]
C502  100n  [CAPC0603]
C503  12p  [CAPC0603]
C504  1u  [CAPC0603]
C505  12p  [CAPC0603]
C506  100n  [CAPC0603]
Q501  MMSS8050-L-TP  [SOT190P240X290-3]
Q502  MMSS8050-L-TP  [SOT190P240X290-3]
R501  0R0  [RESC0603]
R502  10k  [RESC0603]
R503  0R0  [RESC0603]
R504  10k  [RESC0603]
R505  0R0  [RESC0603]
R506  10k  [RESC0603]
R507  10k  [RESC0603]
R508  10k  [RESC0603]
U501  ESP32-C3-WROOM-02-N4  [ESP32-C3-WROOM-02-N4]
X501  HEADER6X1  [HDR6W64P254_6X1_1524X254X1150]
Y501  32.768kHz  [XTAL320X150X80]

### Blocks framed on the sheet
Autoprogram: Q501 Q502 R507 R508 X501

### Ports
EDR_OUT (in, see SENSORS[3B]), PPG_SCL (out, see SENSORS[2C]), PPG_SDA (bidir, see SENSORS[2C]), PPG_~{INT} (in, see SENSORS[2C]), USB_D_N (bidir, see USB[1C]), USB_D_P (bidir, see USB[1C])

### Nets
+3.3V: C501.2 C502.2 R502.2 R504.1 R506.2 U501.1(3V3) X501.3
GND: C501.1 C502.1 C503.2 C504.2 C505.2 C506.1 U501.9(GND) U501.19(EPAD) X501.1
CTS: Q501.2(E) R508.1 X501.2
CTS_R: Q502.1(B) R508.2
DTR: Q502.2(E) R507.1 X501.6
DTR_R: Q501.1(B) R507.2
EDR_OUT: C506.2 U501.3(IO4) ; port EDR_OUT
ESP_EN: C504.1 Q501.3(C) R502.1 U501.2(EN)
ESP_IO2: R504.2 U501.16(IO2)
ESP_IO8: R506.1 U501.7(IO8)
ESP_IO9: Q502.3(C) U501.8(IO9)
ESP_OSC_N: R505.1 U501.17(IO1)
ESP_OSC_N_R: C505.1 R503.1 R505.2 Y501.1
ESP_OSC_P: R501.1 U501.18(IO0)
ESP_OSC_P_R: C503.1 R501.2 R503.2 Y501.2
PPG_~{INT}: U501.6(IO7) ; port PPG_~{INT}
PPG_SCL: U501.5(IO6) ; port PPG_SCL
PPG_SDA: U501.4(IO5) ; port PPG_SDA
RXD: U501.11(RXD) X501.5
TXD: U501.12(TXD) X501.4
USB_D_N: U501.13(IO18) ; port USB_D_N
USB_D_P: U501.14(IO19) ; port USB_D_P

Not connected (* = marked no-connect by the designer): U501 10(IO10)* 15(IO3)*

### Notes on the sheet
- ESP32
- ESP32 Pinout
- DTR
- 1
- RTS
- EN
- IO9
- 0

### Library data of the parts
C501 = CAPC0603-10u-20: as C205 on sheet CHARGER; Footprint: 0603; Supplier: Mouser; Link: https://hr.mouser.com/ProductDetail/TAIYO-YUDEN/TMK107BBJ106MA-T?qs=lkMpTOwszhf2a50BCYsq8A%3D%3D
C502 C506 = CAPC0603-100n-10: as C105 on sheet USB; Footprint: 0603; Supplier: Mouser; Link: https://hr.mouser.com/ProductDetail/KEMET/C0603C104K5RACAUTO?qs=8xX%252BF9%252BWV6EZsgKw9G0PqQ%3D%3D
C503 C505 = CAPC0603-12p-1: Ceramic capacitor, 12pF,  100V, C0G; MFR: Murata Electronics; MFRN: GCM1885C2A120FA16D; SPN: 81-GCM1885C2A120FA6D; Checked: Yes; Footprint: 0603; Supplier: Mouser; Link: https://hr.mouser.com/ProductDetail/Murata-Electronics/GCM1885C2A120FA16D?qs=QzBtWTOodeUaZCEup3XR9g%3D%3D
C504 = CAPC0603-1u-10: as C101 on sheet USB; Footprint: 0603; Supplier: Mouser; Link: https://hr.mouser.com/ProductDetail/Murata-Electronics/GRT188R61H105KE13D?qs=drgMNd%252BkGPNIxxtJByMGCg%3D%3D
Q501 Q502 = MMSS8050-L-TP: BJT, NPN, 25V, 1.5A; MFR: Micro Commercial Components (MCC); SPN: 833-MMSS8050-L-TP; Checked: No; Footprint: SOT23-3; Supplier: Mouser; MFRN: MMSS8050-L-TP; Link: https://hr.mouser.com/ProductDetail/Micro-Commercial-Components-MCC/MMSS8050-L-TP?qs=FaVZESsvgnebflbaqJWJVQ%3D%3D
R501 R503 R505 = RES0603-0R0-1: as R103 on sheet USB; Footprint: 0603; Supplier: Mouser; Link: https://hr.mouser.com/ProductDetail/YAGEO/RC0603FR-070RL?qs=0yPvnVz5%2FmpDQv43TwvCfw%3D%3D
R502 R504 R506-R508 = RES0603-10k-1: as R101 on sheet USB; Footprint: 0603; Supplier: Mouser; Link: https://hr.mouser.com/ProductDetail/YAGEO/RC0603FR-1010KL?qs=sGAEpiMZZMtlubZbdhIBIHvQf5egq9lvqRHakiGwa0o%3D
U501 = ESP32-C3-WROOM-02-N4: RF transceiver module, Bluetooth, WiFi; MFR: Espressif Systems; SPN: 356-ESP32C3WROOM02N4; Checked: Yes; Supplier: Mouser; MFRN: ESP32-C3-WROOM-02-N4; Link: https://hr.mouser.com/ProductDetail/Espressif-Systems/ESP32-C3-WROOM-02-N4?qs=sGAEpiMZZMu3sxpa5v1qrhrB%252BBlYHY1O2YkhFjq1w70%3D
X501 = HEADER6X1: Pin header, 6x1, 100mil pitch; MFR: Adam Tech; MFRN: PH1-06-UA; SPN: 737-PH1-06-UA; Checked: Yes; Footprint: HEADER6X1; Supplier: Mouser; Link: https://hr.mouser.com/ProductDetail/Adam-Tech/PH1-06-UA?qs=HoCaDK9Nz5eIYt3TJpOa9Q%3D%3D
Y501 = FC-135R 32.7680KA-AC: Crystal, 32.768Hz, 9pF, 50kOhms; MFR: Seiko Epson; SPN: 732-5R32.7680KA-AC; Checked: Yes; Footprint: SMD3215-2P; Supplier: Mouser; MFRN: FC-135R 32.7680KA-AC; Link: https://hr.mouser.com/ProductDetail/Epson-Timing/FC-135R-32.7680KA-AC?qs=f9yNj16SXrKSyqlBEaNvJg%3D%3D

## Nets that join several sheets
+0.5VREF: POWER (C307.2 C308.2 U303.4 U303.5), SENSORS (R401.2 R403.1)
+1.8V: POWER (C310.2 U304.5), SENSORS (C407.2 C408.2 U402.11)
+3.3V: POWER (5 pins), SENSORS (5 pins), WIRELESS (7 pins)
+3.3VUSBPD: USB (8 pins), CHARGER (R210.1)
+5V: POWER (C302.2 R301.2 U301.5), SENSORS (C405.2 C406.2 U402.9 U402.10)
GND: USB (17 pins), CHARGER (21 pins), POWER (15 pins), SENSORS (13 pins), WIRELESS (9 pins)
VBUS_OUT: USB (C102.2 Q101.5 Q101.6 U101.11), CHARGER (C206.2 U201.22)
VSYS: CHARGER (C205.2 L201.2 U201.13 U201.14), POWER (10 pins)
EDR_OUT: SENSORS (U401.7), WIRELESS (C506.2 U501.3)
PPG_~{INT}: SENSORS (R406.1 U402.13), WIRELESS (U501.6)
PPG_SCL: SENSORS (R405.1 U402.2), WIRELESS (U501.5)
PPG_SDA: SENSORS (R404.1 U402.3), WIRELESS (U501.4)
USB_D_N: USB (X101.A7 X101.B7), WIRELESS (U501.13)
USB_D_P: USB (X101.A6 X101.B6), WIRELESS (U501.14)

## Assembly variants
Production: not fitted R110 R503